# EAGLE design breakout-lrtb-g6tg_light (EAGLE 6.5.0)
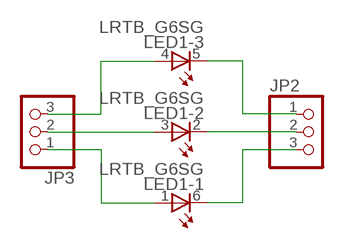
[diagram p0: schematic, sheet 1]

## Parts
JP2  PINHD-1X3  [1X03]
JP3  PINHD-1X3  [1X03]
LED1  LRTB_G6SG  [LRTB_G6SG]

## Nets
N$4: JP3.2 LED1.3(-2:A)
N$5: JP3.3 LED1.4(-3:A)
N$6: JP3.1 LED1.1(-1:A)
N$7: JP2.3 LED1.6(-1:C)
N$8: JP2.1 LED1.5(-3:C)
N$9: JP2.2 LED1.2(-2:C)

## Library data of the parts
JP2 JP3 = pinhead:PINHD-1X3: PIN HEADER
LED1 = led:LRTB_G6SG: LRTB G6SG 6-lead TOPLED® Source: OSRAM Opto Semiconductors ... LRTB_G6SG_Pb_free.pdf

## Board
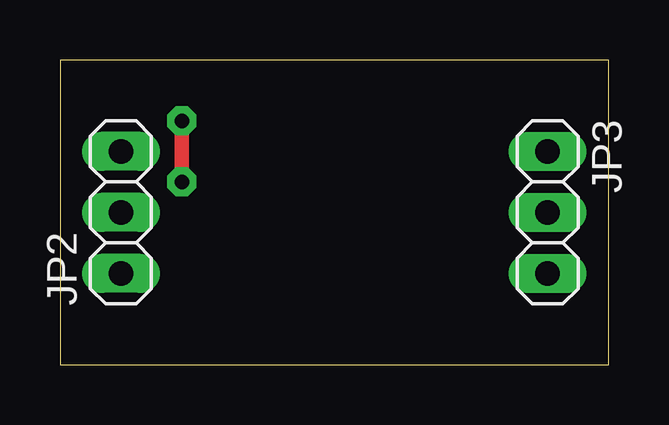
[diagram p1: board, top side]
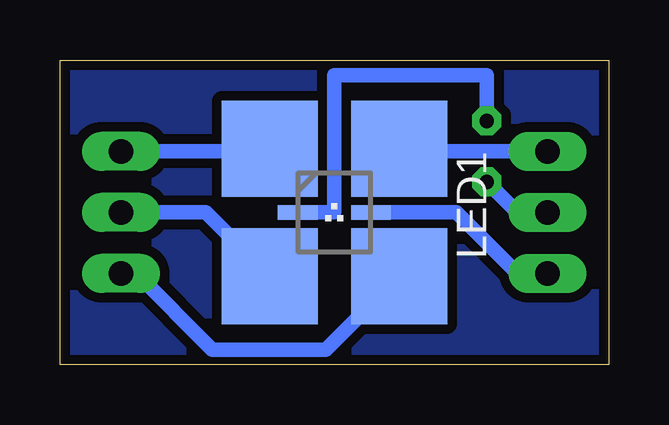
[diagram p2: board, bottom side, seen from below]

Size 22.86 x 12.7 mm. Coordinates in mm from the lower left corner, seen from the top.
Outline: 0,0 22.86,0 22.86,12.7 0,12.7 0,0
Copper layers (1*16): Top 0.035mm / dielectric 1.5mm / Bottom 0.035mm
Design rules "default *": minimum track width 16mil, minimum drill 24mil, track to track 16mil, track to pad 16mil, pad to pad 16mil, via to via 16mil, smd to smd 8mil, copper to edge 16mil, drill to drill 8mil, minimum pad ring 12mil, minimum via ring 12mil, stop-mask expansion 4mil, vias tented up to drill 0mil, thermal gap 10mil
bRestrict: area 14,5.7 to 15.9,7; area 10.8,1.9 to 12.1,5.7; area 5.7,10.8 to 6.3,11.4; area 0,4.4 to 1.3,8.3; area 21.6,4.4 to 22.9,8.3

### Footprints (pad centres in the part's own frame; a part is rotated, then mirrored left to right if it is on the bottom)
1X03 = drill 1.016 long: 1 -2.54,0; 2 0,0; 3 2.54,0
LRTB_G6SG = smd 4 x 4: 1 -2.65,-2.7; 3 2.65,-2.7; 4 2.65,2.7; 6 -2.65,2.7 | smd 0.6 x 1.65: 2 0,-1.525; 5 0,1.525

### Placement (x,y rotation side)
JP2  2.54,6.35 90 top
JP3  20.32,6.35 270 top
LED1  11.43,6.35 270 bottom

### Tracks (layer width: path | path; a pad name or v marks a point on that pad's centre or on a via)
N$1  (via drill 0.6)
  other vias: 5.08,7.62
N$2  (via drill 0.6)
  other vias: 5.08,10.16
N$4
  Bottom 0.61: JP3.2 16.78,6.35 LED1.3
N$5
  Bottom 0.61: LED1.4 11.79,0.64 16.51,0.64 19.68,3.81 JP3.3
N$6
  Bottom 0.61: LED1.1 14.24,8.89 JP3.1
N$7
  Bottom 0.61: LED1.6 8.62,8.89 JP2.3
N$8
  Bottom 0.61: LED1.5 6.35,6.35 3.81,3.81 JP2.1
N$9  (via drill 0.6)
  Top 0.61: v5.08,10.16 v5.08,7.62
  Bottom 0.61: LED1.2 11.43,6.35 11.43,12.06 5.08,12.06 v5.08,10.16 | v5.08,7.62 3.81,6.35 JP2.2
N$13
  pour Bottom: 22.86,12.7 22.86,0 0,0 0,12.7